# EAGLE design balconyDreams (EAGLE 7.6.0)
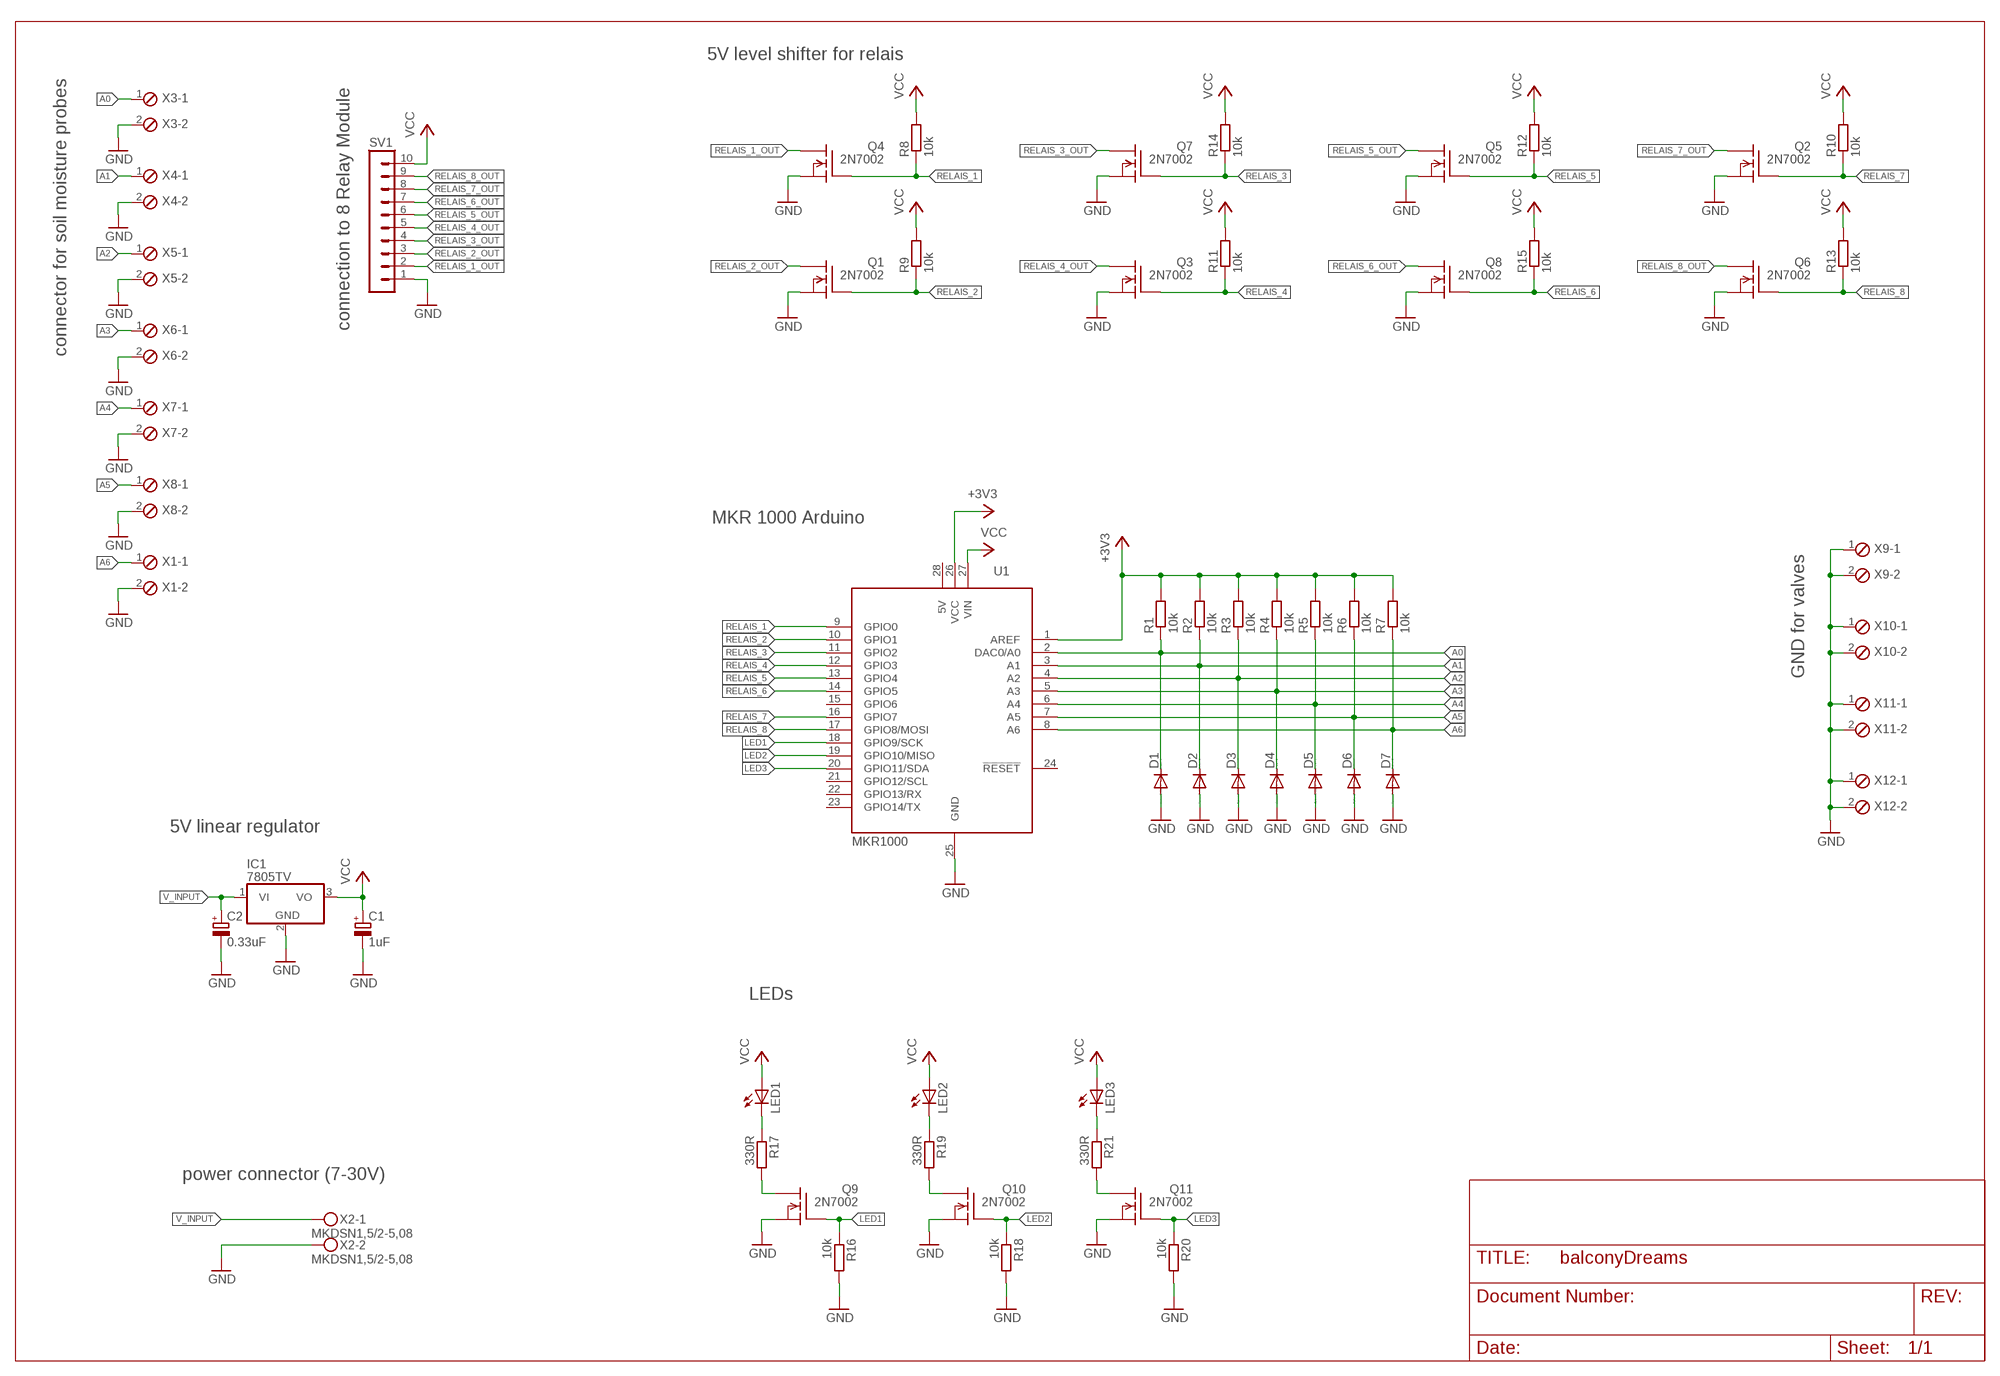
[diagram p0: schematic, sheet 1]

## Parts
C1  1uF  CPOL-EUE5-6  [E5-6]
C2  0.33uF  CPOL-EUE5-6  [E5-6]
D1  DIODE-SOD323-W  [SOD323-W]
D2  DIODE-SOD323-W  [SOD323-W]
D3  DIODE-SOD323-W  [SOD323-W]
D4  DIODE-SOD323-W  [SOD323-W]
D5  DIODE-SOD323-W  [SOD323-W]
D6  DIODE-SOD323-W  [SOD323-W]
D7  DIODE-SOD323-W  [SOD323-W]
IC1  7805TV  [TO220V]
LED1  LEDCHIPLED_0805  [CHIPLED_0805]
LED2  LEDCHIPLED_0805  [CHIPLED_0805]
LED3  LEDCHIPLED_0805  [CHIPLED_0805]
Q1  2N7002  [SOT23]
Q2  2N7002  [SOT23]
Q3  2N7002  [SOT23]
Q4  2N7002  [SOT23]
Q5  2N7002  [SOT23]
Q6  2N7002  [SOT23]
Q7  2N7002  [SOT23]
Q8  2N7002  [SOT23]
Q9  2N7002  [SOT23]
Q10  2N7002  [SOT23]
Q11  2N7002  [SOT23]
R1  10k  R-EU_R0805  [R0805]
R2  10k  R-EU_R0805  [R0805]
R3  10k  R-EU_R0805  [R0805]
R4  10k  R-EU_R0805  [R0805]
R5  10k  R-EU_R0805  [R0805]
R6  10k  R-EU_R0805  [R0805]
R7  10k  R-EU_R0805  [R0805]
R8  10k  R-EU_R0805  [R0805]
R9  10k  R-EU_R0805  [R0805]
R10  10k  R-EU_R0805  [R0805]
R11  10k  R-EU_R0805  [R0805]
R12  10k  R-EU_R0805  [R0805]
R13  10k  R-EU_R0805  [R0805]
R14  10k  R-EU_R0805  [R0805]
R15  10k  R-EU_R0805  [R0805]
R16  10k  R-EU_R0805  [R0805]
R17  330R  R-EU_R0805  [R0805]
R18  10k  R-EU_R0805  [R0805]
R19  330R  R-EU_R0805  [R0805]
R20  10k  R-EU_R0805  [R0805]
R21  330R  R-EU_R0805  [R0805]
SV1  MA10-1  [MA10-1]
U1  MKR1000  [MKR1000]
X1  MPT2  [2POL254]
X2  MKDSN1,5/2-5,08  [MKDSN1,5/2-5,08]
X3  MPT2  [2POL254]
X4  MPT2  [2POL254]
X5  MPT2  [2POL254]
X6  MPT2  [2POL254]
X7  MPT2  [2POL254]
X8  MPT2  [2POL254]
X9  MPT2  [2POL254]
X10  MPT2  [2POL254]
X11  MPT2  [2POL254]
X12  MPT2  [2POL254]

## Nets
+3V3: R1.2 R2.2 R3.2 R4.2 R5.2 R6.2 R7.2 U1.1(AREF) U1.26(VCC)
A0: D1.C R1.1 U1.2(DAC0/A0) X3.1
A1: D2.C R2.1 U1.3(A1) X4.1
A2: D3.C R3.1 U1.4(A2) X5.1
A3: D4.C R4.1 U1.5(A3) X6.1
A4: D5.C R5.1 U1.6(A4) X7.1
A5: D6.C R6.1 U1.7(A5) X8.1
A6: D7.C R7.1 U1.8(A6) X1.1
GND: C1.- C2.- D1.A D2.A D3.A D4.A D5.A D6.A D7.A IC1.2(GND) Q1.2(S) Q2.2(S) Q3.2(S) Q4.2(S) Q5.2(S) Q6.2(S) Q7.2(S) Q8.2(S) Q9.2(S) Q10.2(S) Q11.2(S) R16.2 R18.2 R20.2 SV1.1 U1.25(GND) X1.2 X2.2 X3.2 X4.2 X5.2 X6.2 X7.2 X8.2 X9.1 X9.2 X10.1 X10.2 X11.1 X11.2 X12.1 X12.2
LED1: Q9.1(G) R16.1 U1.18(GPIO9/SCK)
LED2: Q10.1(G) R18.1 U1.19(GPIO10/MISO)
LED3: Q11.1(G) R20.1 U1.20(GPIO11/SDA)
N$1: LED1.C R17.1
N$2: Q9.3(D) R17.2
N$3: Q10.3(D) R19.2
N$4: LED2.C R19.1
N$5: Q11.3(D) R21.2
N$6: LED3.C R21.1
RELAIS_1: Q4.1(G) R8.1 U1.9(GPIO0)
RELAIS_1_OUT: Q4.3(D) SV1.2
RELAIS_2: Q1.1(G) R9.1 U1.10(GPIO1)
RELAIS_2_OUT: Q1.3(D) SV1.3
RELAIS_3: Q7.1(G) R14.1 U1.11(GPIO2)
RELAIS_3_OUT: Q7.3(D) SV1.4
RELAIS_4: Q3.1(G) R11.1 U1.12(GPIO3)
RELAIS_4_OUT: Q3.3(D) SV1.5
RELAIS_5: Q5.1(G) R12.1 U1.13(GPIO4)
RELAIS_5_OUT: Q5.3(D) SV1.6
RELAIS_6: Q8.1(G) R15.1 U1.14(GPIO5)
RELAIS_6_OUT: Q8.3(D) SV1.7
RELAIS_7: Q2.1(G) R10.1 U1.16(GPIO7)
RELAIS_7_OUT: Q2.3(D) SV1.8
RELAIS_8: Q6.1(G) R13.1 U1.17(GPIO8/MOSI)
RELAIS_8_OUT: Q6.3(D) SV1.9
V_INPUT: C2.+ IC1.1(VI) X2.1
VCC: C1.+ IC1.3(VO) LED1.A LED2.A LED3.A R8.2 R9.2 R10.2 R11.2 R12.2 R13.2 R14.2 R15.2 SV1.10 U1.27(VIN)
Unconnected: U1.15(GPIO6) U1.21(GPIO12/SCL) U1.22(GPIO13/RX) U1.23(GPIO14/TX) U1.24(!RESET) U1.28(5V)

## Notes on the sheet
- 5V level shifter for relais
- connection to 8 Relay Module
- connector for soil moisture probes
- MKR 1000 Arduino
- GND for valves
- 5V linear regulator
- LEDs
- power connector (7-30V)

## Library data of the parts
C1 C2 = rcl:CPOL-EU: POLARIZED CAPACITOR, European symbol
D1-D7 = diode:DIODE-: DIODE
IC1 = linear:78*: Positive VOLTAGE REGULATOR Source: http://cache.national.com/ds/LM/LM78L05.pdf http://www.fairchildsemi.com/ds/LM/LM7805.pdf
LED1-LED3 = led:LED: LED OSRAM: - CHIPLED LG R971, LG N971, LY N971, LG Q971, LY Q971, LO R971, LY R971 LH N974, LH R974 LS Q976, LO Q976, LY Q976 LO Q996 - Hyper CHIPLED LW Q18S LB Q993, LB Q99A, LB R99A - SideLED LS A670, LO A670, LY A670, LG A670, LP A670 LB A673, LV A673, LT A673, LW A673 LH A674 LY A675 LS A676, LA A676, LO A676, LY A676, LW A676 LS A679, LY A679, LG A679 - Hyper Micro SIDELED® LS Y876, LA Y876, LO Y876, LY Y876 LT Y87S - SmartLED LW L88C, LW L88S LB L89C, LB L89S, LG L890 LS L89K, LO L89K, LY L89K LS L896, LA L896, LO L896, LY L896 - TOPLED LS T670, LO T670, LY T670, LG T670, LP T670 LSG T670, LSP T670, LSY T670, LOP T670, LYG T670 LG T671, LOG T671, LSG T671 LB T673, LV T673, LT T673, LW T673 LH T674 LS T676, LA T676, LO T676, LY T676, LB T676, LH T676, LSB T676, LW T676 LB T67C, LV T67C, LT T67C, LS T67K, LO T67K, LY T67K, LW E67C LS E67B, LA E67B, LO E67B, LY E67B, LB E67C, LV E67C, LT E67C LW T67C LS T679, LY T679, LG T679 LS T770, LO T770, LY T770, LG T770, LP T770 LB T773, LV T773, LT T773, LW T773 LH T774 LS E675, LA E675, LY E675, LS T675 LS T776, LA T776, LO T776, LY T776, LB T776 LHGB T686 LT T68C, LB T68C - Hyper Mini TOPLED® LB M676 - Mini TOPLED Santana® LG M470 LS M47K, LO M47K, LY M47K Source: http://www.osram.convergy.de LUXEON: - LUMILED® LXK2-PW12-R00, LXK2-PW12-S00, LXK2-PW14-U00, LXK2-PW14-V00 LXK2-PM12-R00, LXK2-PM12-S00, LXK2-PM14-U00 LXK2-PE12-Q00, LXK2-PE12-R00, LXK2-PE12-S00, LXK2-PE14-T00, LXK2-PE14-U00 LXK2-PB12-K00, LXK2-PB12-L00, LXK2-PB12-M00, LXK2-PB14-N00, LXK2-PB14-P00, LXK2-PB14-Q00 LXK2-PR12-L00, LXK2-PR12-M00, LXK2-PR14-Q00, LXK2-PR14-R00 LXK2-PD12-Q00, LXK2-PD12-R00, LXK2-PD12-S00 LXK2-PH12-R00, LXK2-PH12-S00 LXK2-PL12-P00, LXK2-PL12-Q00, LXK2-PL12-R00 Source: www.luxeon.com KINGBRIGHT: KA-3528ASYC Source: www.kingbright.com
Q1-Q11 = transistors_gaui:2N7002
R1-R21 = rcl:R-EU_: RESISTOR, European symbol
SV1 = con-lstb:MA10-1: PIN HEADER; OC_FARNELL: unknown; OC_NEWARK: unknown
U1 = mkr1000:MKR1000
X1 X3-X12 = con-phoenix-254:MPT2: PHOENIX CONNECTOR; OC_FARNELL: unknown; OC_NEWARK: unknown
X2 = con-phoenix-508:MKDSN1,5/2-5,08: MKDSN 1,5/ 2-5,08 Printklemme Nennstrom: 13,5 A Nennspannung: 250 V Rastermaß: 5,08 mm Polzahl: 2 Anschlussart: Schraubanschluss Montage: Löten Anschlussrichtung Leiter/Platine: 0 ° Artikelnummer: 1729128 Source: http://eshop.phoenixcontact.com .. 1729128.pdf

## Board
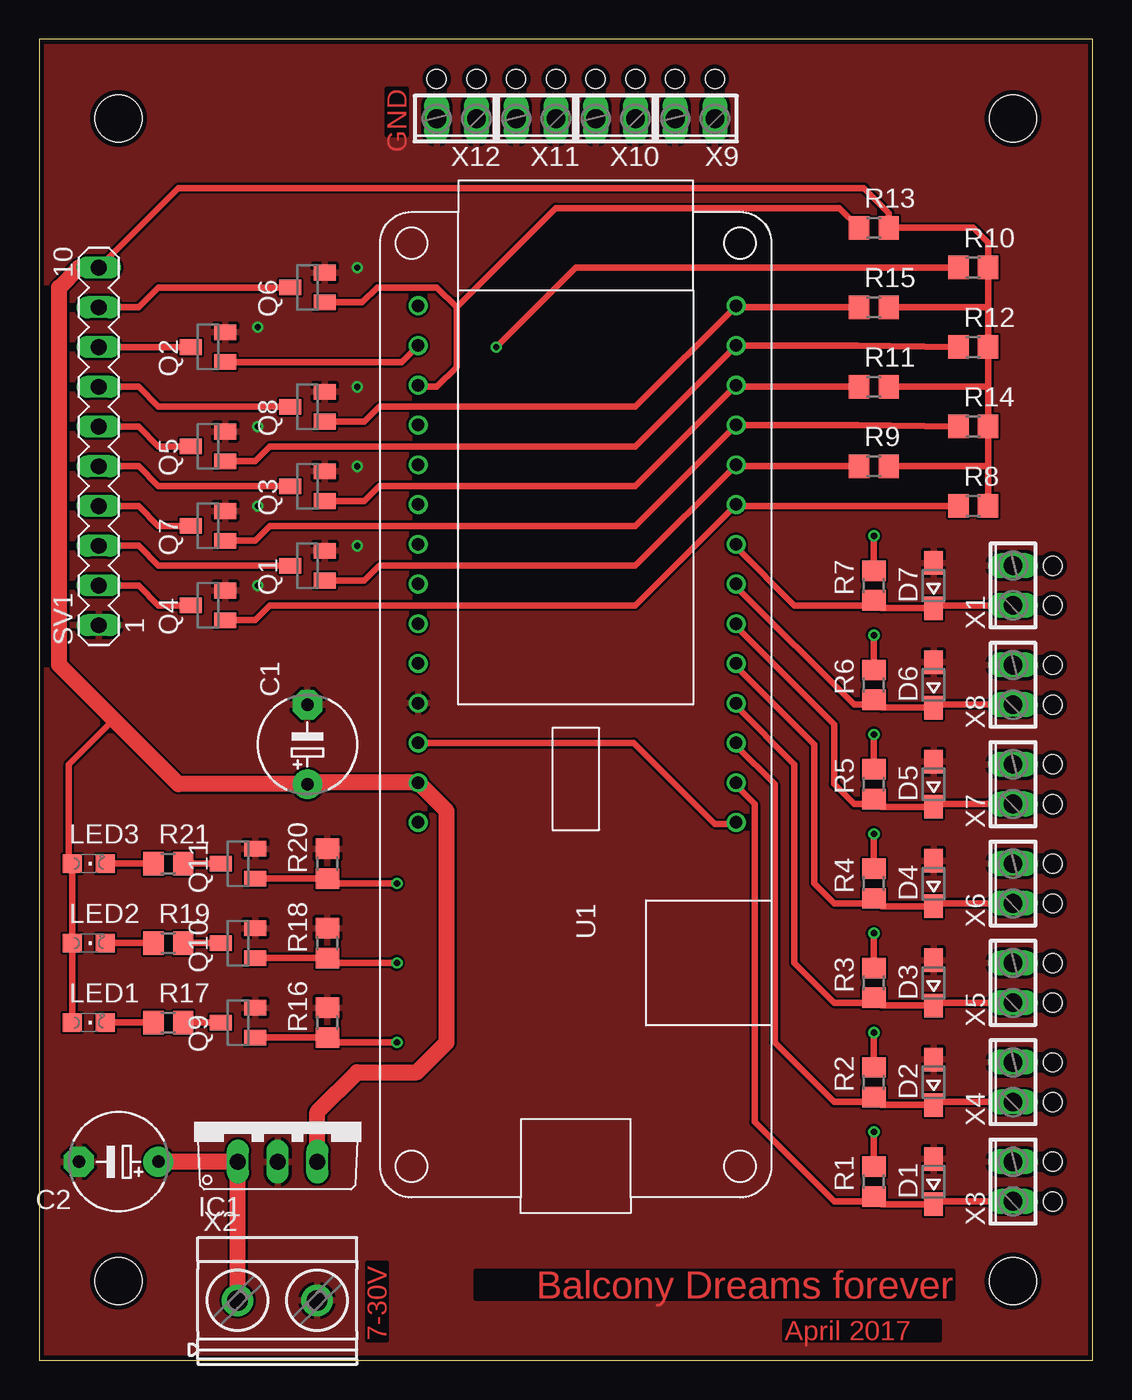
[diagram p1: board, top side]
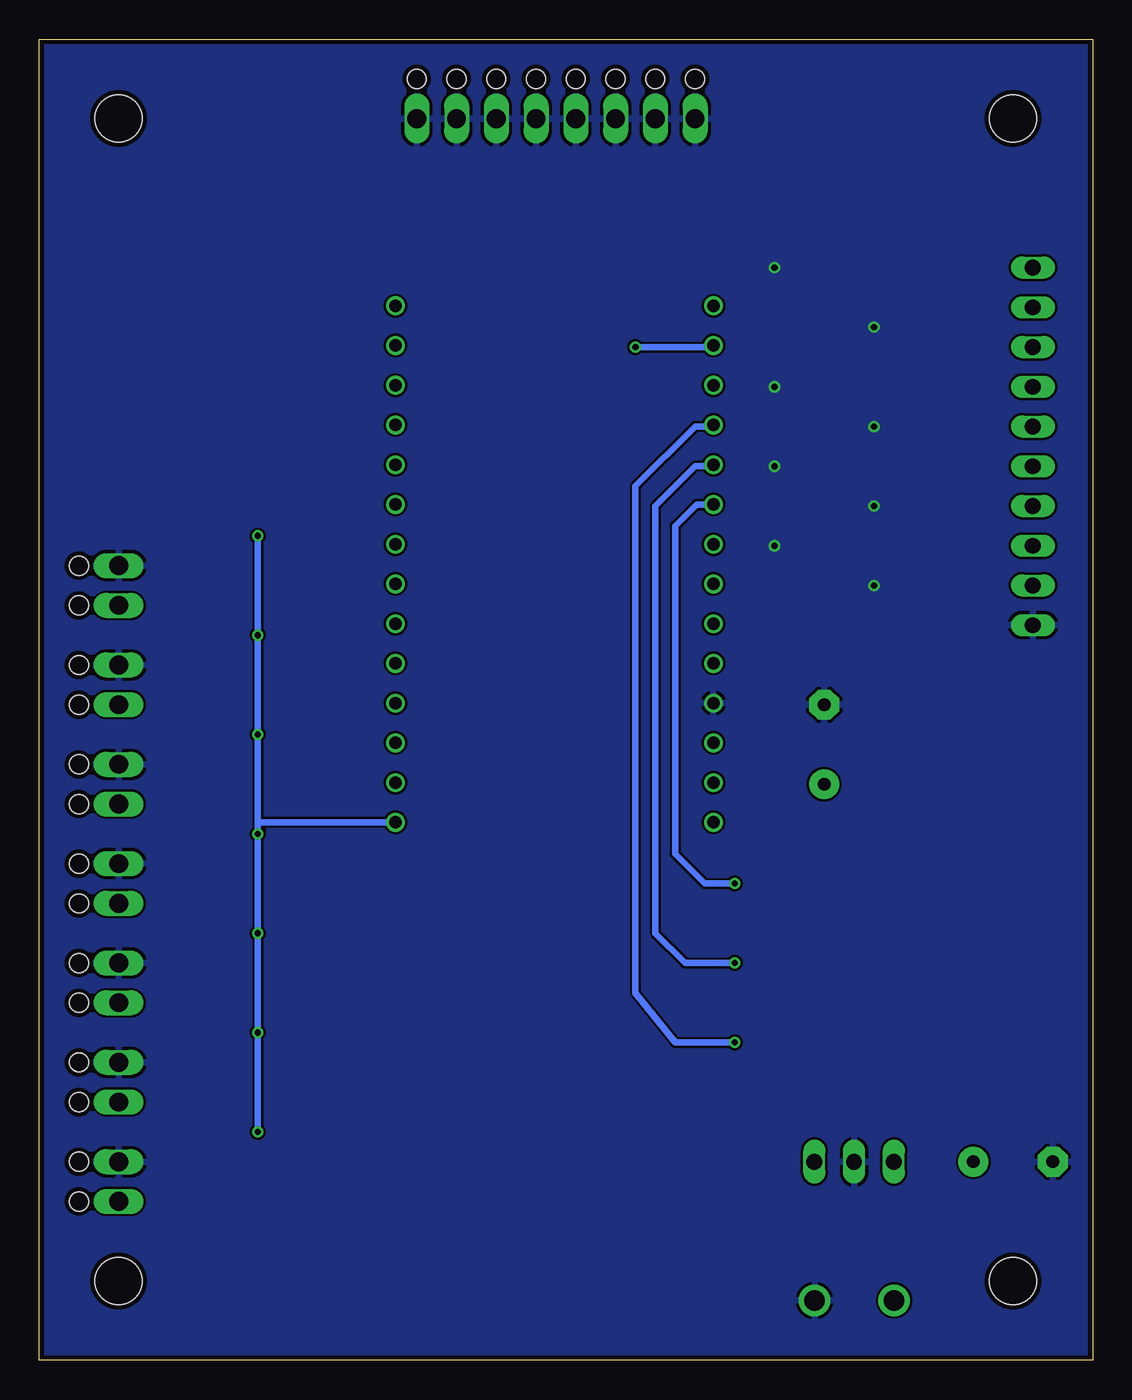
[diagram p2: board, bottom side, seen from below]

Size 67.31 x 84.45 mm. Coordinates in mm from the lower left corner, seen from the top.
Outline: 0,0 67.31,0 67.31,84.45 0,84.44 0,0
Copper layers (1*16): Top 0.035mm / dielectric 1.5mm / Bottom 0.035mm
Design rules "PCB-POOL Standard": minimum track width 0.15mm, minimum drill 0.3mm, track to track 0.15mm, track to pad 0.15mm, pad to pad 0.15mm, via to via 0.15mm, smd to smd 0.15mm, copper to edge 0.3mm, drill to drill 0.2mm, minimum pad ring 0.2mm, minimum via ring 0.15mm, stop-mask expansion 0.075mm, vias tented up to drill 0mil, thermal gap 0.2mm
Holes 1.2 mm at 64.77,10.16 64.77,12.7 64.77,16.51 64.77,19.05 64.77,22.86 64.77,25.4 64.77,29.21 64.77,31.75 64.77,35.56 64.77,38.1 64.77,41.91 64.77,44.45 64.77,48.26 64.77,50.8 43.18,81.92 40.64,81.92 38.1,81.92 35.56,81.92 33.02,81.92 30.48,81.92 27.94,81.92 25.4,81.92
Holes 3 mm at 5.08,5.08 62.23,5.08 5.08,79.38 62.23,79.38

### Footprints (pad centres in the part's own frame; a part is rotated, then mirrored left to right if it is on the bottom)
E5-6 = drill 0.813 pad 1.905: + -2.54,0 | drill 0.813 pad 1.905 octagon: - 2.54,0
SOD323-W = smd 1.5 x 1.2: A 1.45,0; C -1.45,0
TO220V = drill 1.016 long: 1 -2.54,-2.54; 2 0,-2.54; 3 2.54,-2.54
CHIPLED_0805 = smd 1.2 x 1.2: A 0,-1.05; C 0,1.05
SOT23 = smd 1 x 1.4: 1 -0.95,-1.1; 2 0.95,-1.1; 3 0,1.1
R0805 = smd 1.3 x 1.5: 1 -0.95,0; 2 0.95,0
MA10-1 = drill 1.016 long: 1 -11.43,0; 2 -8.89,0; 3 -6.35,0; 4 -3.81,0; 5 -1.27,0; 6 1.27,0; 7 3.81,0; 8 6.35,0; 9 8.89,0; 10 11.43,0
MKR1000 = drill 0.8: 1 -10.25,7.52; 2 -10.25,4.98; 3 -10.25,2.44; 4 -10.25,-0.1; 5 -10.25,-2.64; 6 -10.25,-5.18; 7 -10.25,-7.72; 8 -10.25,-10.26; 9 -10.25,-12.8; 10 -10.25,-15.34; 11 -10.25,-17.88; 12 -10.25,-20.42; 13 -10.25,-22.96; 14 -10.25,-25.5; 15 10.07,-25.5; 16 10.07,-22.96; 17 10.07,-20.42; 18 10.07,-17.88; 19 10.07,-15.34; 20 10.07,-12.8; 21 10.07,-10.26; 22 10.07,-7.72; 23 10.07,-5.18; 24 10.07,-2.64; 25 10.07,-0.1; 26 10.07,2.44; 27 10.07,4.98; 28 10.07,7.52
2POL254 = drill 1.2 long: 1 -1.27,0; 2 1.27,0
MKDSN1,5/2-5,08 = drill 1.3 pad 2: 1 -2.561,0.025; 2 2.519,0.025

### Placement (x,y rotation side)
C1  17.14,39.37 90 top
C2  5.08,12.7 180 top
D1  57.15,11.43 90 top
D2  57.15,17.78 90 top
D3  57.15,24.13 90 top
D4  57.15,30.48 90 top
D5  57.15,36.83 90 top
D6  57.15,43.18 90 top
D7  57.15,49.53 90 top
IC1  15.24,15.24 0 top
LED1  3.17,21.59 270 top
LED2  3.17,26.67 270 top
LED3  3.17,31.75 270 top
Q1  17.14,50.8 90 top
Q2  10.79,64.77 90 top
Q3  17.14,55.88 90 top
Q4  10.79,48.26 90 top
Q5  10.79,58.42 90 top
Q6  17.14,68.58 90 top
Q7  10.79,53.34 90 top
Q8  17.14,60.96 90 top
Q9  12.7,21.59 90 top
Q10  12.7,26.67 90 top
Q11  12.7,31.75 90 top
R1  53.34,11.43 90 top
R2  53.34,17.78 90 top
R3  53.34,24.13 90 top
R4  53.34,30.48 90 top
R5  53.34,36.83 90 top
R6  53.34,43.18 90 top
R7  53.34,49.53 90 top
R8  59.69,54.61 0 top
R9  53.34,57.15 0 top
R10  59.69,69.85 0 top
R11  53.34,62.23 0 top
R12  59.69,64.77 0 top
R13  53.34,72.39 0 top
R14  59.69,59.69 0 top
R15  53.34,67.31 0 top
R16  18.41,21.59 90 top
R17  8.26,21.59 0 top
R18  18.41,26.67 90 top
R19  8.26,26.67 0 top
R20  18.41,31.75 90 top
R21  8.26,31.75 0 top
SV1  3.81,58.42 90 top
U1  34.29,41.91 180 top
X1  62.23,49.53 90 top
X2  15.24,3.81 0 top
X3  62.23,11.43 90 top
X4  62.23,17.78 90 top
X5  62.23,24.13 90 top
X6  62.23,30.48 90 top
X7  62.23,36.83 90 top
X8  62.23,43.18 90 top
X9  41.91,79.38 180 top
X10  36.83,79.38 180 top
X11  31.75,79.38 180 top
X12  26.67,79.38 180 top

### Tracks (layer width: path | path; a pad name or v marks a point on that pad's centre or on a via)
+3V3  (via drill 0.4)
  Top 0.406: U1.26 38,39.47 43.18,34.29 44.44,34.29 U1.1 | 53.02,44.45 R6.2 v53.34,46.35 | R7.2 v53.34,52.7 | R5.2 v53.34,40.01 | R4.2 v53.34,33.66 | R3.2 v53.34,27.3 | R2.2 v53.34,20.95 | R1.2 v53.34,14.61
  Bottom 0.406: v53.34,52.7 v53.34,46.35 v53.34,40.01 53.34,34.29 | 53.34,34.29 v53.34,33.66 v53.34,27.3 v53.34,20.95 v53.34,14.61 | U1.1 53.24,34.39 53.34,34.29
A0
  Top 0.406: U1.2 44.54,36.74 45.72,35.56 45.72,15.24 50.8,10.16 53.02,10.16 R1.1 53.84,9.98 D1.C 57.33,10.16 X3.1
A1
  Top 0.406: U1.3 44.54,39.28 46.99,36.83 46.99,20.32 50.8,16.51 53.02,16.51 R2.1 53.84,16.33 D2.C 57.33,16.51 X4.1
A2
  Top 0.406: U1.4 44.54,41.82 48.26,38.1 48.26,25.4 50.8,22.86 53.02,22.86 R3.1 53.84,22.68 D3.C 57.33,22.86 X5.1
A3
  Top 0.406: U1.5 44.54,44.36 49.53,39.37 49.53,30.48 50.8,29.21 53.02,29.21 R4.1 53.84,29.03 D4.C 57.33,29.21 X6.1
A4
  Top 0.406: U1.6 44.54,46.9 50.8,40.64 50.8,36.83 52.07,35.56 53.02,35.56 R5.1 53.84,35.38 D5.C 57.33,35.56 X7.1
A5
  Top 0.406: U1.7 44.54,49.44 52.07,41.91 53.02,41.91 R6.1 53.84,41.73 D6.C 57.33,41.91 X8.1
A6
  Top 0.406: U1.8 44.54,51.98 48.26,48.26 53.02,48.26 R7.1 53.84,48.08 D7.C 57.33,48.26 X1.1
GND  (via drill 0.4)
  other vias: 20.32,69.85 13.97,66.04 20.32,62.23 13.97,59.69 20.32,57.15 13.97,54.61 20.32,52.07 13.97,49.53
  pour Bottom: -3.17,86.36 69.22,86.36 69.22,-1.91 -3.17,-1.91
  pour Top: -1.91,85.72 68.58,85.72 68.58,-0.64 -1.27,-1.27 -1.27,0.64 -1.91,0.64
LED1  (via drill 0.4)
  Top 0.406: Q9.1 R16.1 18.41,20.32 v22.86,20.32
  Bottom 0.406: U1.18 24.32,59.69 25.4,59.69 29.21,55.88 29.21,23.5 26.67,20.32 v22.86,20.32
LED2  (via drill 0.4)
  Top 0.406: Q10.1 R18.1 18.41,25.4 v22.86,25.4
  Bottom 0.406: U1.19 24.32,57.15 25.4,57.15 27.94,54.61 27.94,27.3 26.04,25.4 v22.86,25.4
LED3  (via drill 0.4)
  Top 0.406: Q11.1 R20.1 18.41,30.48 v22.86,30.48
  Bottom 0.406: U1.20 25.3,54.71 26.67,53.34 26.67,32.38 24.77,30.48 v22.86,30.48
N$1
  Top 0.406: LED1.C R17.1
N$2
  Top 0.406: R17.2 Q9.3
N$3
  Top 0.406: Q10.3 R19.2
N$4
  Top 0.406: R19.1 LED2.C
N$5
  Top 0.406: R21.2 Q11.3
N$6
  Top 0.406: LED3.C R21.1
RELAIS_1
  Top 0.406: Q4.1 13.8,47.31 14.75,48.26 38.1,48.26 U1.9 44.64,54.61 R8.1
RELAIS_1_OUT
  Top 0.406: SV1.2 6.35,49.53 7.62,48.26 Q4.3
RELAIS_2
  Top 0.406: Q1.1 20.79,49.85 21.73,50.8 38.1,50.8 U1.10 44.64,57.15 R9.1
RELAIS_2_OUT
  Top 0.406: SV1.3 6.35,52.07 7.62,50.8 Q1.3
RELAIS_3
  Top 0.406: U1.11 | U1.11 38.1,53.34 14.75,53.34 13.8,52.39 Q7.1 | U1.11 52.3,59.78 R14.1
RELAIS_3_OUT
  Top 0.406: SV1.4 6.35,54.61 7.62,53.34 Q7.3
RELAIS_4
  Top 0.406: U1.12 44.45,62.23 | 44.45,62.23 38.1,55.88 21.73,55.88 20.79,54.93 Q3.1 | R11.1 44.45,62.23
RELAIS_4_OUT
  Top 0.406: SV1.5 6.35,57.15 7.62,55.88 Q3.3
RELAIS_5
  Top 0.406: R12.1 52.29,64.87 U1.13 38.1,58.42 14.75,58.42 13.8,57.47 Q5.1
RELAIS_5_OUT
  Top 0.406: SV1.6 6.35,59.69 7.62,58.42 Q5.3
RELAIS_6
  Top 0.406: Q8.1 20.79,60.01 21.73,60.96 38.1,60.96 U1.14 44.64,67.31 R15.1
RELAIS_6_OUT
  Top 0.406: SV1.7 6.35,62.23 7.62,60.96 Q8.3
RELAIS_7  (via drill 0.4)
  Top 0.406: Q2.1 23.17,63.82 U1.16 | R10.1 34.29,69.85 v29.21,64.77
  Bottom 0.406: v29.21,64.77 24.32,64.77 U1.16
RELAIS_7_OUT
  Top 0.406: SV1.8 Q2.3
RELAIS_8
  Top 0.406: Q6.1 20.64,67.63 21.59,68.58 25.4,68.58 26.67,67.31 | 26.67,67.31 26.67,63.5 25.4,62.23 24.32,62.23 U1.17 | 26.67,67.31 33.02,73.66 51.12,73.66 R13.1
RELAIS_8_OUT
  Top 0.406: SV1.9 6.35,67.31 7.62,68.58 Q6.3
V_INPUT
  Top 1.016: X2.1 12.68,12.68 IC1.1 C2.+
VCC
  Top 0.406: SV1.10 8.89,74.93 52.7,74.93 54.29,73.34 R13.2 59.69,72.39 60.64,71.44 R10.2 60.64,67.31 | 60.64,67.31 R12.2 60.64,62.23 | 60.64,62.23 R14.2 60.64,57.15 | 60.64,57.15 R8.2 | R9.2 60.64,57.15 | R11.2 60.64,62.23 | R15.2 60.64,67.31 | 1.91,21.81 LED1.A LED2.A LED3.A 1.91,31.97 1.91,38.1 4.76,40.96
  Top 1.016: SV1.10 2.54,69.85 1.27,68.58 1.27,44.45 4.76,40.96 8.89,36.83 C1.+ 17.78,36.83 17.88,36.93 U1.27 26.04,35.12 26.04,20.32 24.13,18.41 20.32,18.41 17.78,15.88 IC1.3

### Text on the board
Top: GND | Balcony Dreams forever | 7-30V | April 2017